# Altium schematic sheet MAIN.SchDoc
size A4
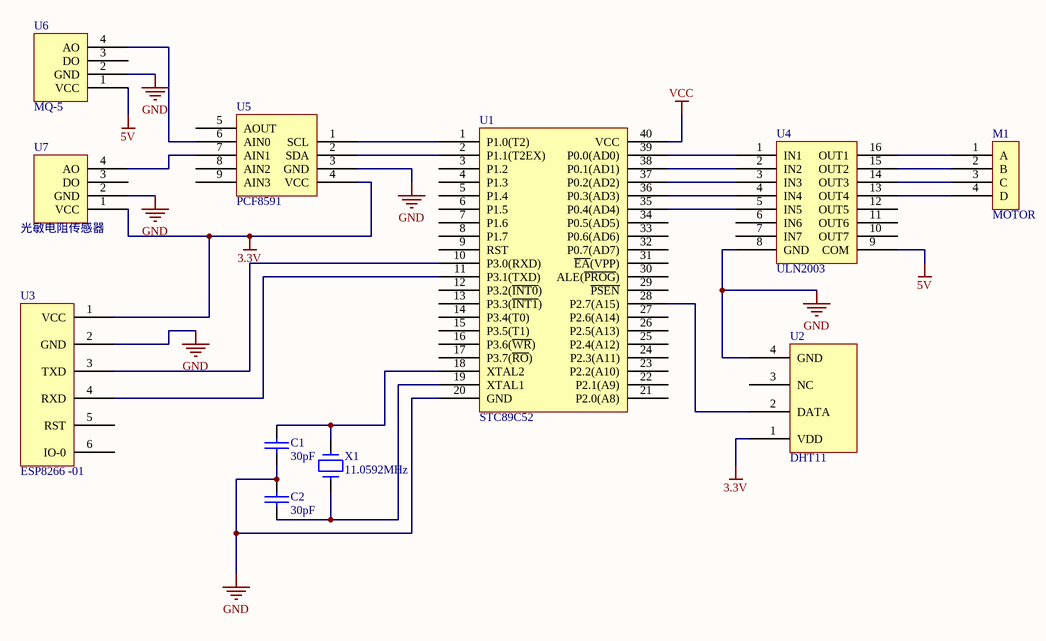
[diagram p0: MAIN.SchDoc]

## Parts
C1  30pF  [RAD-0.1]
C2  30pF  [RAD-0.1]
M1  MOTOR
U1  STC89C52  [DIP40]
U2  DHT11  [P04A]
U3  ESP8266 -01  [P04A]
U4  ULN2003
U5  PCF8591
U6  MQ-5
U7  光敏电阻传感器
X1  11.0592MHz  [XTAL]

## Nets
3.3V: U2.1(VDD) U3.1(VCC) U5.4(VCC) U7.1(VCC)
5V: U4.9(COM) U6.1(VCC)
GND: C1.2 C2.1 U1.20(GND) U2.4(GND) U3.2(GND) U4.8(GND) U5.3(GND) U6.2(GND) U7.2(GND)
VCC: U1.40(VCC)
NetC1_1: C1.1 U1.18(XTAL2) X1.1
NetC2_2: C2.2 U1.19(XTAL1) X1.2
NetM1_1: M1.1(A) U4.16(OUT1)
NetM1_2: M1.2(B) U4.15(OUT2)
NetM1_3: M1.3(C) U4.14(OUT3)
NetM1_4: M1.4(D) U4.13(OUT4)
NetU1_1: U1.1(P1.0(T2)) U5.1(SCL)
NetU1_2: U1.2(P1.1(T2EX)) U5.2(SDA)
NetU1_10: U1.10(P3.0(RXD)) U3.3(TXD)
NetU1_11: U1.11(P3.1(TXD)) U3.4(RXD)
NetU1_28: U1.28(P2.7(A15)) U2.2(DATA)
NetU1_35: U1.35(P0.4(AD4)) U4.5(IN5)
NetU1_36: U1.36(P0.3(AD3)) U4.4(IN4)
NetU1_37: U1.37(P0.2(AD2)) U4.3(IN3)
NetU1_38: U1.38(P0.1(AD1)) U4.2(IN2)
NetU1_39: U1.39(P0.0(AD0)) U4.1(IN1)
NetU5_6: U5.6(AIN0) U6.4(AO)
NetU5_7: U5.7(AIN1) U7.4(AO)

Not connected (* = marked no-connect by the designer): U1 3(P1.2) 4(P1.3) 5(P1.4) 6(P1.5) 7(P1.6) 8(P1.7) 9(RST) 12(P3.2(~{INT0})) 13(P3.3(~{INT1})) 14(P3.4(T0)) 15(P3.5(T1)) 16(P3.6(~{WR})) 17(P3.7(~{RO})) 21(P2.0(A8)) 22(P2.1(A9)) 23(P2.2(A10)) 24(P2.3(A11)) 25(P2.4(A12)) 26(P2.5(A13)) 27(P2.6(A14)) 29(~{PSEN}) 30(ALE(~{PROG})) 31(~{EA}(VPP)) 32(P0.7(AD7)) 33(P0.6(AD6)) 34(P0.5(AD5)); U2 3(NC); U3 5(RST) 6(IO-0); U4 6(IN6) 7(IN7) 10(OUT7) 11(OUT6) 12(OUT5); U5 5(AOUT) 8(AIN2) 9(AIN3); U6 3(DO); U7 3(DO)

## Library data of the parts
C1 C2 = CAP
U1 = 89C52
X1 = CRYSTAL